# EAGLE design Relay4ChannelBoard (EAGLE 9.6.2)
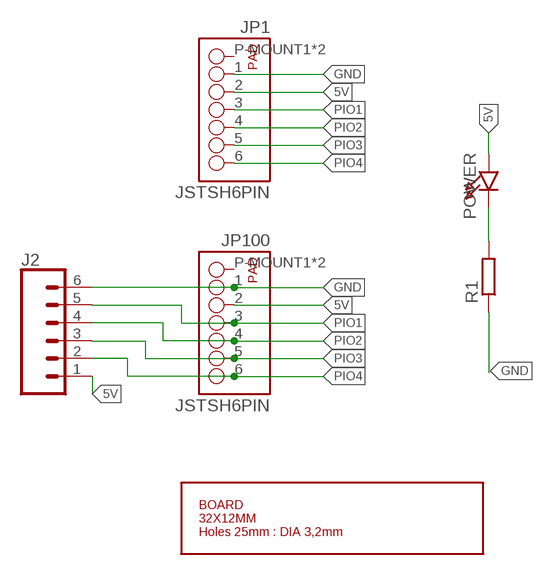
[diagram p0: schematic, sheet 1]

## Parts
J2  CONN_06SILK_FEMALE_PTH  [1X06]
JP1  JSTSH6PIN  [SM06B-SRSS-TB]
JP100  JSTSH6PIN  [SM06B-SRSS-TB]
POWER  RED  LED0805  [CHIPLED_0805]
R1  RESISTORR805-0805  [R805]
U$1  BOARD32X12  [OVAL3212MM]

## Nets
5V: J2.1 JP1.2 JP100.2 POWER.A
GND: J2.6 JP1.1 JP100.1 R1.1
N$23: POWER.C R1.2
PIO1: J2.5 JP1.3 JP100.3
PIO2: J2.4 JP1.4 JP100.4
PIO3: J2.3 JP1.5 JP100.5
PIO4: J2.2 JP1.6 JP100.6
Unconnected: JP1.P-MOUNT1 JP1.P-MOUNT2 JP100.P-MOUNT1 JP100.P-MOUNT2

## Library data of the parts
J2 = SparkFun-Connectors:CONN_06: Multi connection point. Often used as Generic Header-pin footprint for 0.1 inch spaced/style header connections On any of the 0.1 inch spaced packages, you can populate with these: Break Away Headers - Straight <https://www.sparkfun.com/products/116> (PRT-00116) Break Away Male Headers - Right Angle <https://www.sparkfun.com/products/553> (PRT-00553) Female Headers <https://www.sparkfun.com/products/115> (PRT-00115) Break Away Headers - Machine Pin <https://www.sparkfun.com/products/117> (PRT-00117) Break Away Female Headers - Swiss Machine Pin <https://www.sparkfun.com/products/743> (PRT-00743) Arduino Stackable Header - 6 Pin <https://www.sparkfun.com/products/9280> (PRT-09280) For SCREWTERMINALS and SPRING TERMINALS visit here: Screw Terimnals on SparkFun.com <https://www.sparkfun.com/search/results?term=Screw+Terminals> (5mm/3.5mm/2.54mm spacing) This device is also useful as a general connection point to wire up your design to another part of your project. Our various solder wires solder well into these plated through hole pads. Hook-Up Wire - Assortment (Stranded, 22 AWG) <https://www.sparkfun.com/products/11375> (PRT-11375) Hook-Up Wire - Assortment (Solid Core, 22 AWG) <https://www.sparkfun.com/products/11367> (PRT-11367) View the entire wire category on our website here <https://www.sparkfun.com/categories/141>; PROD_ID: CONN-08437
JP1 JP100 = con-jst-shMax:JSTSH6PIN
POWER = microbuilder:LED: LED 0603 - 0603 Surface Mount Package 2mA: Green LED - Low Power (3.9mcd, 2ma, 1.7Vf) - Digikey: 475-2709-2-ND Orange LED - Low Power (9.8mcd, 2ma, 1.8Vf) - Digikey: 475-1194-2-ND Red LED - Low Power (5mcd, 2ma, 1.8Vf) - Digikey: 475-1195-2-ND Yellow LED - Low Power (7mcd, 2ma, 1.8Vf) - Digikey: 475-1196-2-ND 5mA: Blue LED - Low Power (17mcd, 5ma, 2.9Vf) - Digikey: LNJ937W8CRACT-ND 0805 - 0805 Surface Mount Package 2mA: Red LED (8.8mcd, 2mA, 1.8Vf, Clear) - Low Power [Digikey: 475-2510-1-ND] Green LED (5mcd, 2mA, 1.8Vf, Clear) - Low Power [Digikey: 475-2730-1-ND] Yellow LED (11.3mcd, 2mA, 1.8Vf, Clear) - Low Power [Digikey: 475-2555-1-ND] 20mA: Red LED (104mcd, 20mA, Diffused) - LS R976 [Digikey: 475-1278-6-ND] Red LED (12mcd, 20mA, 2.0Vf, Clear) - APT2012EC [Digikey: 754-1128-1-ND] Green LED (15mcd, 20mA, 2.2Vf, Clear) - APT2012GC [Digikey: 754-1131-1-ND] Orange LED (160mcd, 20mA, 2.1Vf, Clear) - APT2012SECK [Digikey: 754-1130-1-ND] 1206 - 1206 Surface Mount Package Green LED (26mcd, 20mA, Diffused) - LG N971 [Digikey: 475-1407-6-ND] Red LED (15mcd, 20mA, Diffused) - LH N974 [Digikey: 475-1416-6-ND]
R1 = dp_devices:RESISTOR
U$1 = MyBreadBoards:BOARD32X12

## Board
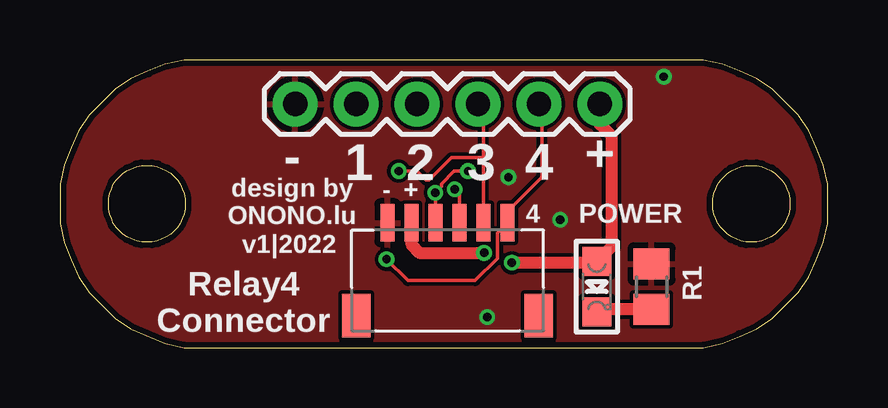
[diagram p1: board, top side]
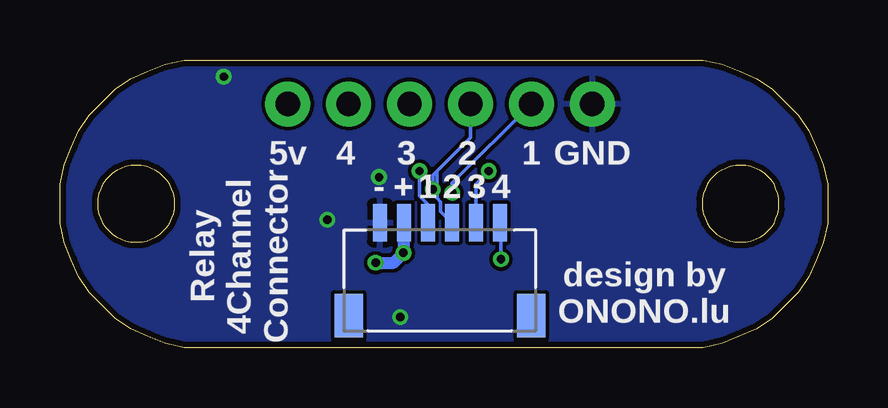
[diagram p2: board, bottom side, seen from below]

Size 32 x 12 mm. Coordinates in mm from the lower left corner, seen from the top.
Copper layers (1*16): Top 0.035mm / dielectric 1.5mm / Bottom 0.035mm
Design rules "dirt_cheap_dirty_boards.v1.1": minimum track width 6mil, minimum drill 12mil, track to track 6mil, track to pad 6mil, pad to pad 6mil, via to via 6mil, smd to smd 0mil, copper to edge 10mil, drill to drill 10mil, minimum pad ring 10mil, minimum via ring 6mil, stop-mask expansion 2mil, vias tented up to drill 25mil, thermal gap 10mil

### Footprints (pad centres in the part's own frame; a part is rotated, then mirrored left to right if it is on the bottom)
1X06 = drill 1.016 pad 1.88: 1 0,0; 2 2.54,0; 3 5.08,0; 4 7.62,0; 5 10.16,0; 6 12.7,0
SM06B-SRSS-TB = smd 0.6 x 1.55: 1 -7.58,4.445; 2 -6.58,4.445; 3 -5.58,4.445; 4 -4.58,4.445; 5 -3.58,4.445; 6 -2.58,4.445 | smd 1.2 x 1.8: P-MOUNT1 -8.88,0.57; P-MOUNT2 -1.28,0.57
CHIPLED_0805 = smd 1.2 x 1.2: A 0,-1.05; C 0,1.05
R805 = smd 1.3 x 1.5: 1 -0.95,0; 2 0.95,0

### Placement (x,y rotation side)
J2  22.51,10.16 180 top
JP1  11.08,0.76 0 bottom
JP100  21.24,0.76 0 top
POWER  22.38,2.54 180 top
R1  24.67,2.54 270 top
U$1  -0.23,-0.26 0 top

### Tracks (layer width: path | path; a pad name or v marks a point on that pad's centre or on a via)
5V  (via drill 0.35)
  Top 0.508: v17.68,3.95 17.67,3.94 15.01,3.94 14.66,4.29 JP100.2 | v18.84,3.54 22.33,3.54 POWER.A 22.99,4.2 22.99,8.83 22.51,9.32 J2.1
  Bottom 0.508: JP1.2 17.66,3.97 v17.68,3.95 18.09,3.54 v18.84,3.54
GND  (via drill 0.35)
  other vias: 18.7,7.11 17.81,1.27 20.86,5.33 25.17,11.3
  pour Bottom: -1.88,12.7 -1.88,0 0.15,-2.03 31.27,-2.03 33.94,0.63 33.94,11.3 31.78,13.46 -0.99,13.46 -1.75,12.7
  pour Top: -1.88,12.7 -1.88,0 0.15,-2.03 31.27,-2.03 33.94,0.63 33.94,11.3 31.78,13.46 -0.99,13.46 -1.75,12.7
N$23
  Top 0.508: R1.2 22.48,1.59 POWER.C
PIO1  (via drill 0.35)
  Top 0.152: JP100.3 15.66,6.45 v15.65,6.46 15.9,6.71 15.9,6.83 16.43,7.36 v17.01,7.36
  Bottom 0.152: J2.5 15.65,6.86 v15.65,6.46 | v17.01,7.36 17.01,6.31 16.66,5.96 JP1.3
PIO2  (via drill 0.35)
  Top 0.152: JP100.4 16.66,6.4 v16.46,6.6
  Bottom 0.152: JP1.4 16.13,5.68 16.13,6.08 16.28,6.23 16.28,7.36 | 16.28,7.36 14.89,8.76 J2.4 | 16.28,7.36 16.46,7.19 v16.46,6.6
PIO3  (via drill 0.35)
  Top 0.152: 17.68,5.23 JP100.5 17.66,7.36 17.66,8 | 17.66,8 17.66,9.93 J2.3 | v14.12,7.36 14.89,7.36 15.27,6.98 15.39,6.98 16.32,7.92 17.58,7.92 17.66,8
  Bottom 0.152: JP1.5 14.66,6.83 v14.12,7.36
PIO4  (via drill 0.35)
  Top 0.152: JP100.6 18.66,5.59 | JP100.6 18.66,5.67 20.09,7.11 20.09,10.03 J2.2 | JP100.6 18.24,4.79 18.24,3.72 17.31,2.79 14.51,2.79 v13.62,3.68
  Bottom 0.152: v13.62,3.68 13.62,5.17 JP1.6

### Text on the board
tPlace: - | 1 | 2 | 3 | 4 | + | - | + | design by / ONONO.lu | 4 | v1|2022 | Relay4 / Connector
bPlace: GND | 1 | 2 | 3 | 4 | 5v | 4 | 3 | 2 | 1 | + | - | Relay / 4Channel / Connector | design by / ONONO.lu